# EAGLE schematic ARE_adaptadores_final (EAGLE 6.1)

## Sheet 1 of 4: dsPIC / 24F / PIC32 64pin
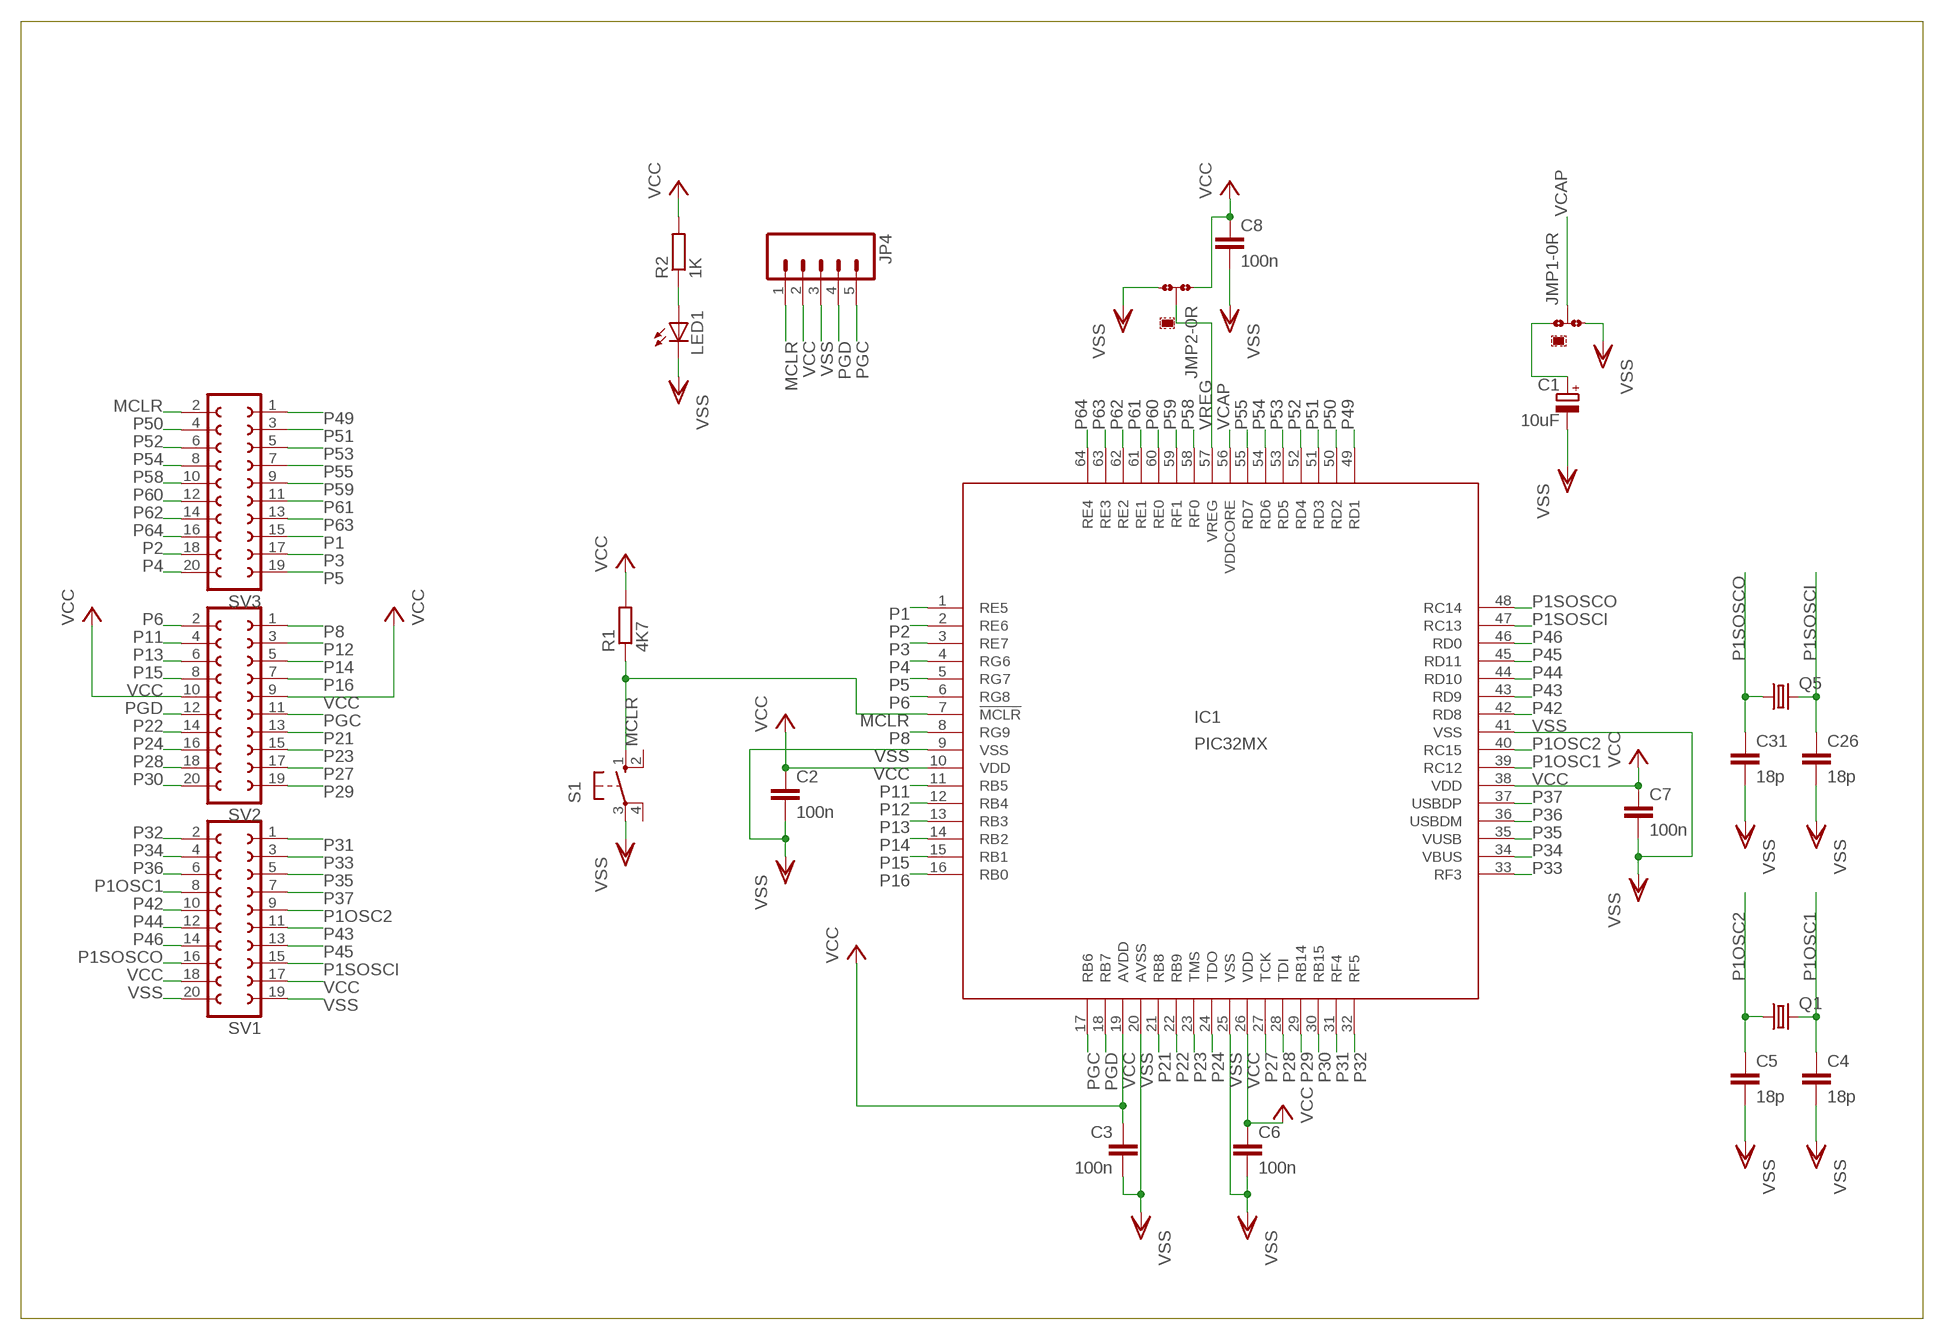
[diagram p0: schematic, sheet 1]

### Parts
C1  10uF  CPOL-EUSMCC  [SMC_C]
C2  100n  C-EUC0805  [C0805]
C3  100n  C-EUC0805  [C0805]
C4  18p  C-EUC0805  [C0805]
C5  18p  C-EUC0805  [C0805]
C6  100n  C-EUC0805  [C0805]
C7  100n  C-EUC0805  [C0805]
C8  100n  C-EUC0805  [C0805]
C26  18p  C-EUC0805  [C0805]
C31  18p  C-EUC0805  [C0805]
IC1  PIC32MX  PIC32MX440F256H  [TQFP64-10X10]
JMP1  0R-JUMPA  [A0R-JMP]
JMP2  0R-JUMPA  [A0R-JMP]
JP4  M05PTH  [1X05]
LED1  LEDCHIPLED_0805  [CHIPLED_0805]
Q1  CRYSTALHC18U-V  [HC18U-V]
Q5  CRYSTALHC18U-V  [HC18U-V]
R1  4K7  R-EU_R0805  [R0805]
R2  1K  R-EU_R0805  [R0805]
S1  10-XX  [B3F-10XX]
SV1  FE10-2W  [FE10-2W]
SV2  FE10-2W  [FE10-2W]
SV3  FE10-2W  [FE10-2W]

### Nets
MCLR: IC1.7(!MCLR) JP4.1 R1.1 S1.1(S) SV3.2
N$1: LED1.A R2.1
N$5: C1.+ JMP1.1
P1: IC1.1(RE5) SV3.15
P1OSC1: C4.1 IC1.39(RC12) Q1.2 SV1.8
P1OSC2: C5.1 IC1.40(RC15) Q1.1 SV1.9
P1SOSCI: C26.1 IC1.47(RC13) Q5.2 SV1.15
P1SOSCO: C31.1 IC1.48(RC14) Q5.1 SV1.16
P2: IC1.2(RE6) SV3.18
P3: IC1.3(RE7) SV3.17
P4: IC1.4(RG6) SV3.20
P5: IC1.5(RG7) SV3.19
P6: IC1.6(RG8) SV2.2
P8: IC1.8(RG9) SV2.1
P11: IC1.11(RB5) SV2.4
P12: IC1.12(RB4) SV2.3
P13: IC1.13(RB3) SV2.6
P14: IC1.14(RB2) SV2.5
P15: IC1.15(RB1) SV2.8
P16: IC1.16(RB0) SV2.7
P21: IC1.21(RB8) SV2.13
P22: IC1.22(RB9) SV2.14
P23: IC1.23(TMS) SV2.15
P24: IC1.24(TDO) SV2.16
P27: IC1.27(TCK) SV2.17
P28: IC1.28(TDI) SV2.18
P29: IC1.29(RB14) SV2.19
P30: IC1.30(RB15) SV2.20
P31: IC1.31(RF4) SV1.1
P32: IC1.32(RF5) SV1.2
P33: IC1.33(RF3) SV1.3
P34: IC1.34(VBUS) SV1.4
P35: IC1.35(VUSB) SV1.5
P36: IC1.36(USBDM) SV1.6
P37: IC1.37(USBDP) SV1.7
P42: IC1.42(RD8) SV1.10
P43: IC1.43(RD9) SV1.11
P44: IC1.44(RD10) SV1.12
P45: IC1.45(RD11) SV1.13
P46: IC1.46(RD0) SV1.14
P49: IC1.49(RD1) SV3.1
P50: IC1.50(RD2) SV3.4
P51: IC1.51(RD3) SV3.3
P52: IC1.52(RD4) SV3.6
P53: IC1.53(RD5) SV3.5
P54: IC1.54(RD6) SV3.8
P55: IC1.55(RD7) SV3.7
P58: IC1.58(RF0) SV3.10
P59: IC1.59(RF1) SV3.9
P60: IC1.60(RE0) SV3.12
P61: IC1.61(RE1) SV3.11
P62: IC1.62(RE2) SV3.14
P63: IC1.63(RE3) SV3.13
P64: IC1.64(RE4) SV3.16
PGC: IC1.17(RB6) JP4.5 SV2.11
PGD: IC1.18(RB7) JP4.4 SV2.12
VCAP: IC1.56(VDDCORE) JMP1.2
VCC: C2.1 C3.1 C6.1 C7.1 C8.1 IC1.10(VDD) IC1.19(AVDD) IC1.26(VDD) IC1.38(VDD) JMP2.1 JP4.2 R1.2 R2.2 SV1.17 SV1.18 SV2.9 SV2.10 ; also sheet 2,3,4
VREG: IC1.57(VREG) JMP2.2
VSS: C1.- C2.2 C3.2 C4.2 C5.2 C6.2 C7.2 C8.2 C26.2 C31.2 IC1.9(VSS) IC1.20(AVSS) IC1.25(VSS) IC1.41(VSS) JMP1.3 JMP2.3 JP4.3 LED1.C S1.3(P) SV1.19 SV1.20 ; also sheet 2,3,4
Unconnected: S1.2(S1) S1.4(P1)

## Sheet 2 of 4: dsPIC / 24F / PIC32 44 pin
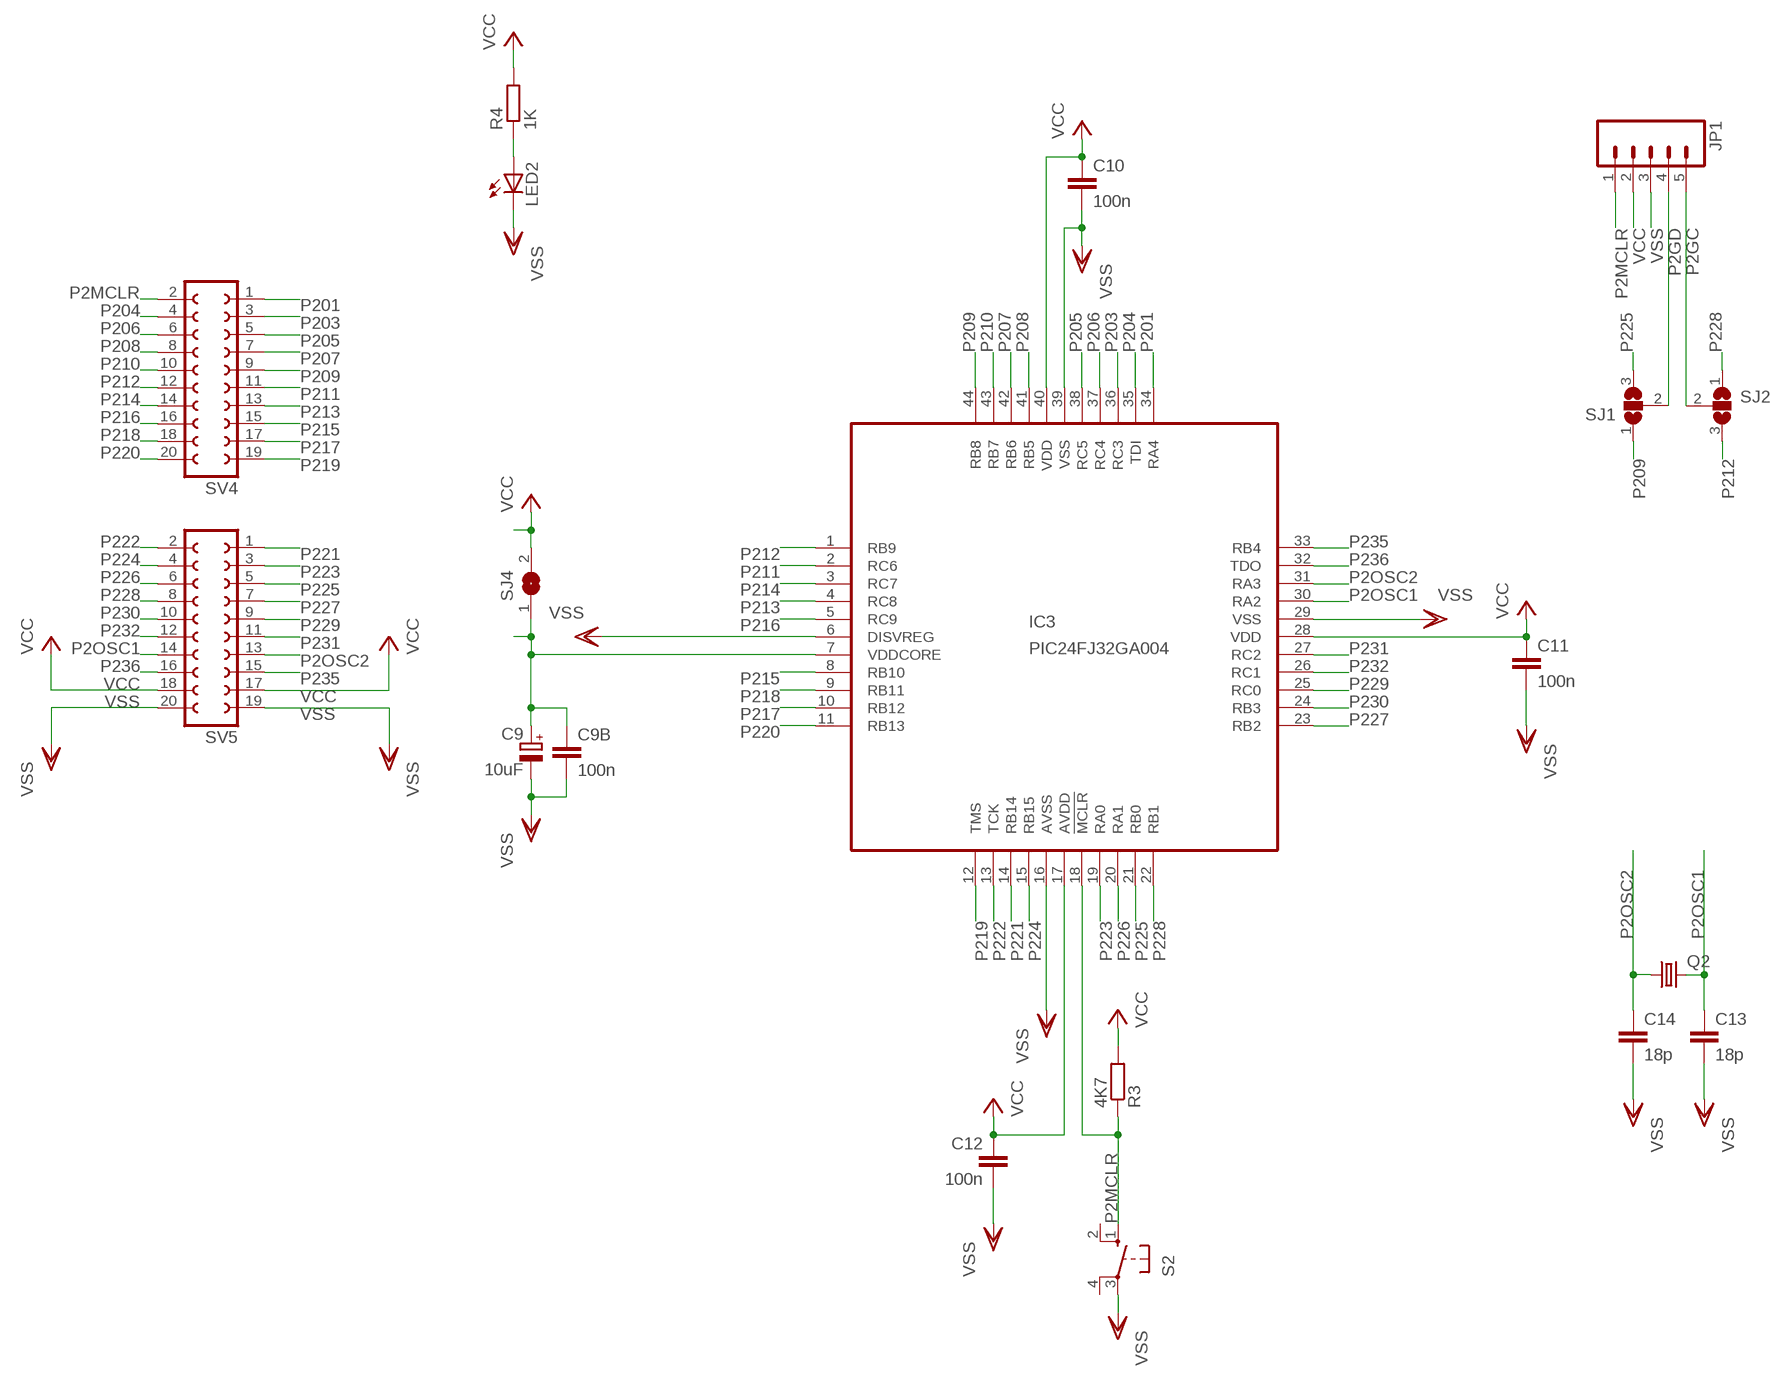
[diagram p1: schematic, sheet 2]

### Parts
C9  10uF  CPOL-EUSMCC  [SMC_C]
C9B  100n  C-EUC0805  [C0805]
C10  100n  C-EUC0805  [C0805]
C11  100n  C-EUC0805  [C0805]
C12  100n  C-EUC0805  [C0805]
C13  18p  C-EUC0805  [C0805]
C14  18p  C-EUC0805  [C0805]
IC3  PIC24FJ32GA004  [TQFP44]
JP1  M05PTH  [1X05]
LED2  LEDCHIPLED_0805  [CHIPLED_0805]
Q2  CRYSTALHC18U-V  [HC18U-V]
R3  4K7  R-EU_R0805  [R0805]
R4  1K  R-EU_R0805  [R0805]
S2  10-XX  [B3F-10XX]
SJ1  SJ2W  [SJ_2]
SJ2  SJ2W  [SJ_2]
SJ4  SJ  [SJ]
SV4  FE10-2W  [FE10-2W]
SV5  FE10-2W  [FE10-2W]

### Nets
N$2: LED2.A R4.1
N$11: C9.+ C9B.1 IC3.7(VDDCORE) SJ4.1
P2GC: JP1.5 SJ2.2
P2GD: JP1.4 SJ1.2
P2MCLR: IC3.18(!MCLR) JP1.1 R3.1 S2.1(S) SV4.2
P2OSC1: C13.1 IC3.30(RA2) Q2.2 SV5.14
P2OSC2: C14.1 IC3.31(RA3) Q2.1 SV5.13
P201: IC3.34(RA4) SV4.1
P203: IC3.36(RC3) SV4.3
P204: IC3.35(TDI) SV4.4
P205: IC3.38(RC5) SV4.5
P206: IC3.37(RC4) SV4.6
P207: IC3.42(RB6) SV4.7
P208: IC3.41(RB5) SV4.8
P209: IC3.44(RB8) SJ1.1 SV4.9
P210: IC3.43(RB7) SV4.10
P211: IC3.2(RC6) SV4.11
P212: IC3.1(RB9) SJ2.3 SV4.12
P213: IC3.4(RC8) SV4.13
P214: IC3.3(RC7) SV4.14
P215: IC3.8(RB10) SV4.15
P216: IC3.5(RC9) SV4.16
P217: IC3.10(RB12) SV4.17
P218: IC3.9(RB11) SV4.18
P219: IC3.12(TMS) SV4.19
P220: IC3.11(RB13) SV4.20
P221: IC3.14(RB14) SV5.1
P222: IC3.13(TCK) SV5.2
P223: IC3.19(RA0) SV5.3
P224: IC3.15(RB15) SV5.4
P225: IC3.21(RB0) SJ1.3 SV5.5
P226: IC3.20(RA1) SV5.6
P227: IC3.23(RB2) SV5.7
P228: IC3.22(RB1) SJ2.1 SV5.8
P229: IC3.25(RC0) SV5.9
P230: IC3.24(RB3) SV5.10
P231: IC3.27(RC2) SV5.11
P232: IC3.26(RC1) SV5.12
P235: IC3.33(RB4) SV5.15
P236: IC3.32(TDO) SV5.16
VCC: C10.1 C11.1 C12.1 IC3.17(AVDD) IC3.28(VDD) IC3.40(VDD) JP1.2 R3.2 R4.2 SJ4.2 SV5.17 SV5.18 ; also sheet 1,3,4
VSS: C9.- C9B.2 C10.2 C11.2 C12.2 C13.2 C14.2 IC3.6(DISVREG) IC3.16(AVSS) IC3.29(VSS) IC3.39(VSS) JP1.3 LED2.C S2.3(P) SV5.19 SV5.20 ; also sheet 1,3,4
Unconnected: S2.2(S1) S2.4(P1)

## Sheet 3 of 4: PIC 16F / 18F 44 pin
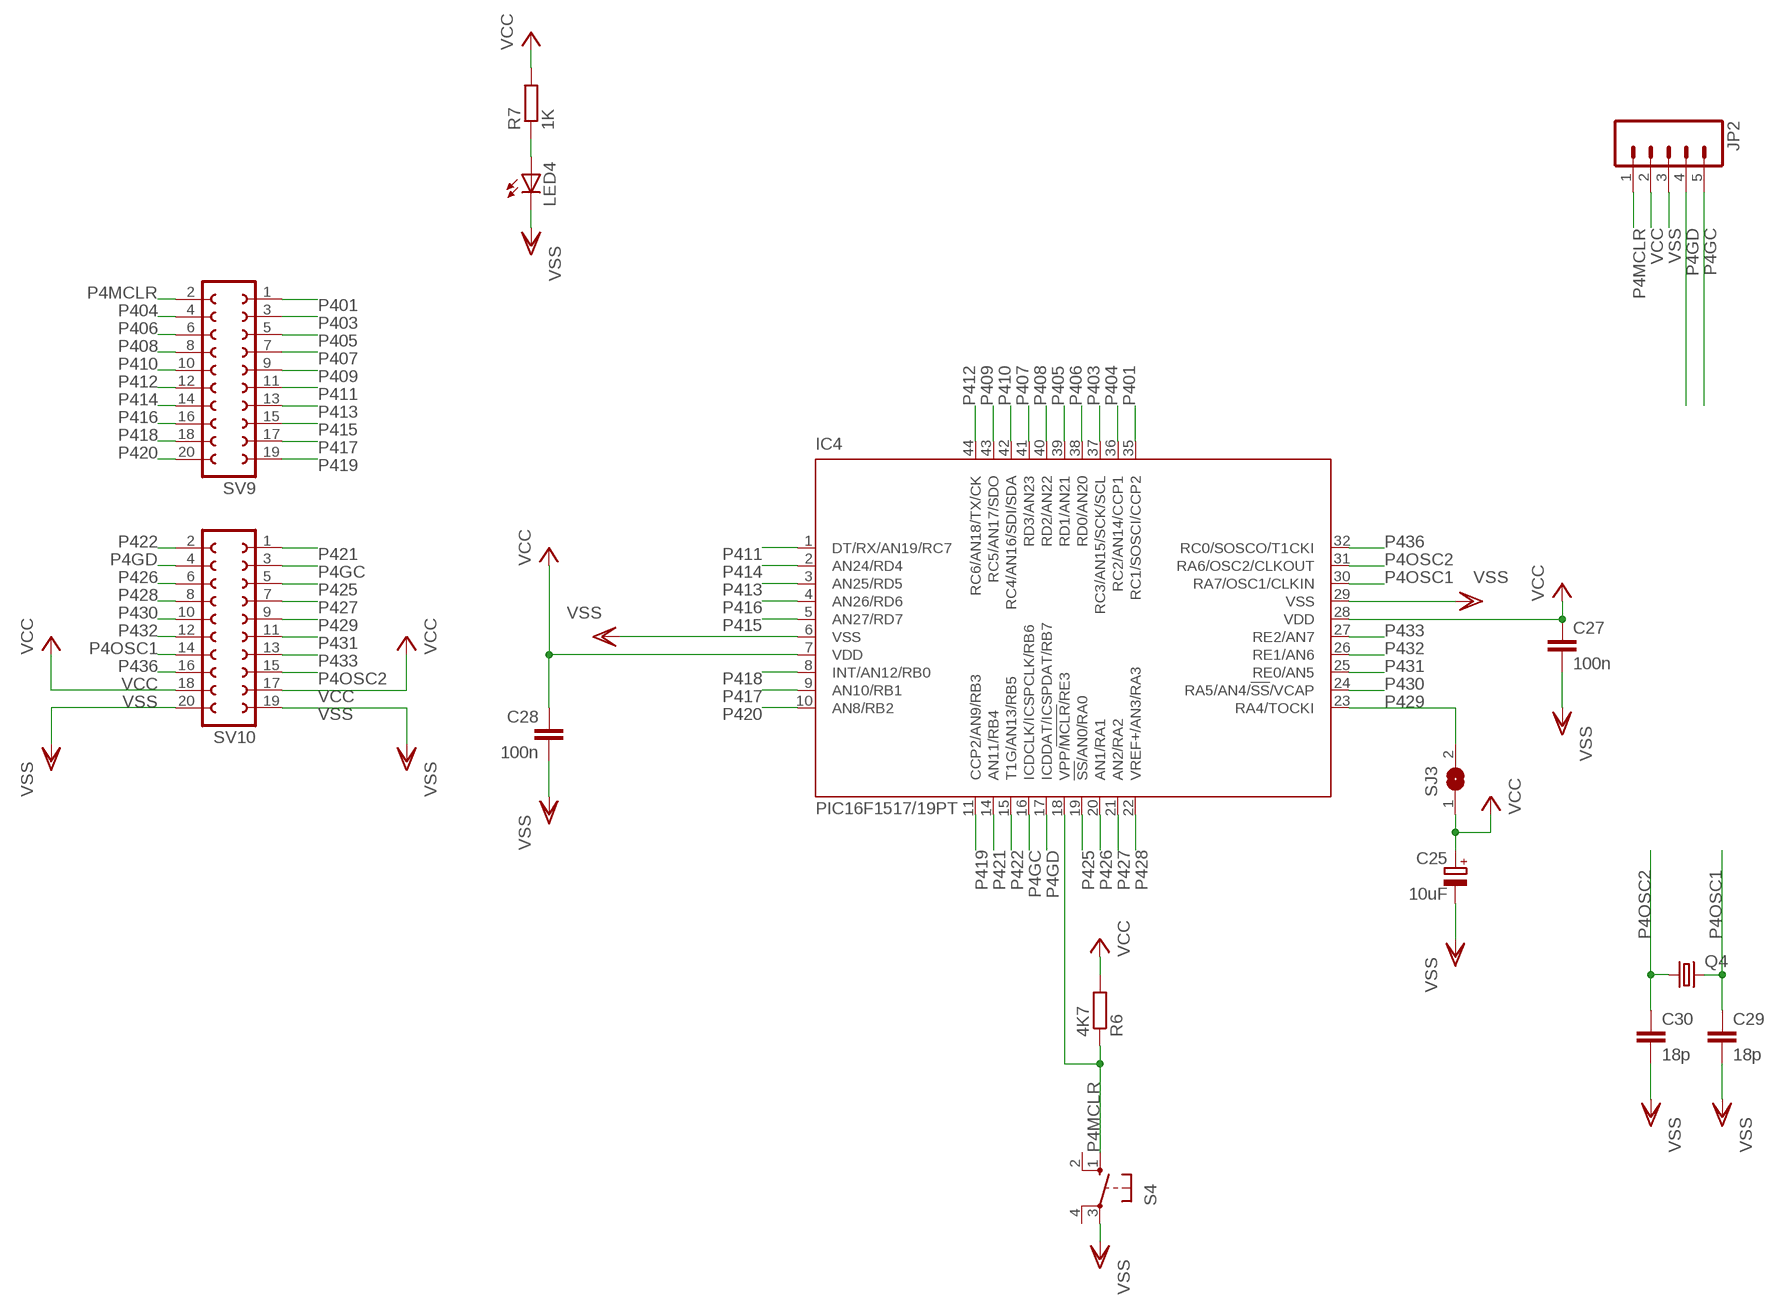
[diagram p2: schematic, sheet 3]

### Parts
C25  10uF  CPOL-EUSMCC  [SMC_C]
C27  100n  C-EUC0805  [C0805]
C28  100n  C-EUC0805  [C0805]
C29  18p  C-EUC0805  [C0805]
C30  18p  C-EUC0805  [C0805]
IC4  PIC16F1517/19PT  [TQFP44]
JP2  M05PTH  [1X05]
LED4  LEDCHIPLED_0805  [CHIPLED_0805]
Q4  CRYSTALHC18U-V  [HC18U-V]
R6  4K7  R-EU_R0805  [R0805]
R7  1K  R-EU_R0805  [R0805]
S4  10-XX  [B3F-10XX]
SJ3  SJ  [SJ]
SV9  FE10-2W  [FE10-2W]
SV10  FE10-2W  [FE10-2W]

### Nets
N$4: LED4.A R7.1
P4GC: IC4.16(ICDCLK/ICSPCLK/RB6) JP2.5 SV10.3
P4GD: IC4.17(ICDDAT/ICSPDAT/RB7) JP2.4 SV10.4
P4MCLR: IC4.18(VPP/!MCLR!/RE3) JP2.1 R6.1 S4.1(S) SV9.2
P4OSC1: C29.1 IC4.30(RA7/OSC1/CLKIN) Q4.2 SV10.14
P4OSC2: C30.1 IC4.31(RA6/OSC2/CLKOUT) Q4.1 SV10.15
P401: IC4.35(RC1/SOSCI/CCP2) SV9.1
P403: IC4.37(RC3/AN15/SCK/SCL) SV9.3
P404: IC4.36(RC2/AN14/CCP1) SV9.4
P405: IC4.39(RD1/AN21) SV9.5
P406: IC4.38(RD0/AN20) SV9.6
P407: IC4.41(RD3/AN23) SV9.7
P408: IC4.40(RD2/AN22) SV9.8
P409: IC4.43(RC5/AN17/SDO) SV9.9
P410: IC4.42(RC4/AN16/SDI/SDA) SV9.10
P411: IC4.1(DT/RX/AN19/RC7) SV9.11
P412: IC4.44(RC6/AN18/TX/CK) SV9.12
P413: IC4.3(AN25/RD5) SV9.13
P414: IC4.2(AN24/RD4) SV9.14
P415: IC4.5(AN27/RD7) SV9.15
P416: IC4.4(AN26/RD6) SV9.16
P417: IC4.9(AN10/RB1) SV9.17
P418: IC4.8(INT/AN12/RB0) SV9.18
P419: IC4.11(CCP2/AN9/RB3) SV9.19
P420: IC4.10(AN8/RB2) SV9.20
P421: IC4.14(AN11/RB4) SV10.1
P422: IC4.15(T1G/AN13/RB5) SV10.2
P425: IC4.19(!SS!/AN0/RA0) SV10.5
P426: IC4.20(AN1/RA1) SV10.6
P427: IC4.21(AN2/RA2) SV10.7
P428: IC4.22(VREF+/AN3/RA3) SV10.8
P429: IC4.23(RA4/TOCKI) SJ3.2 SV10.9
P430: IC4.24(RA5/AN4/!SS!/VCAP) SV10.10
P431: IC4.25(RE0/AN5) SV10.11
P432: IC4.26(RE1/AN6) SV10.12
P433: IC4.27(RE2/AN7) SV10.13
P436: IC4.32(RC0/SOSCO/T1CKI) SV10.16
VCC: C25.+ C27.1 C28.1 IC4.7(VDD) IC4.28(VDD) JP2.2 R6.2 R7.2 SJ3.1 SV10.17 SV10.18 ; also sheet 1,2,4
VSS: C25.- C27.2 C28.2 C29.2 C30.2 IC4.6(VSS) IC4.29(VSS) JP2.3 LED4.C S4.3(P) SV10.19 SV10.20 ; also sheet 1,2,4
Unconnected: S4.2(S1) S4.4(P1)

## Sheet 4 of 4: PIC 10F / 12F / 16F 8pin / 14pin
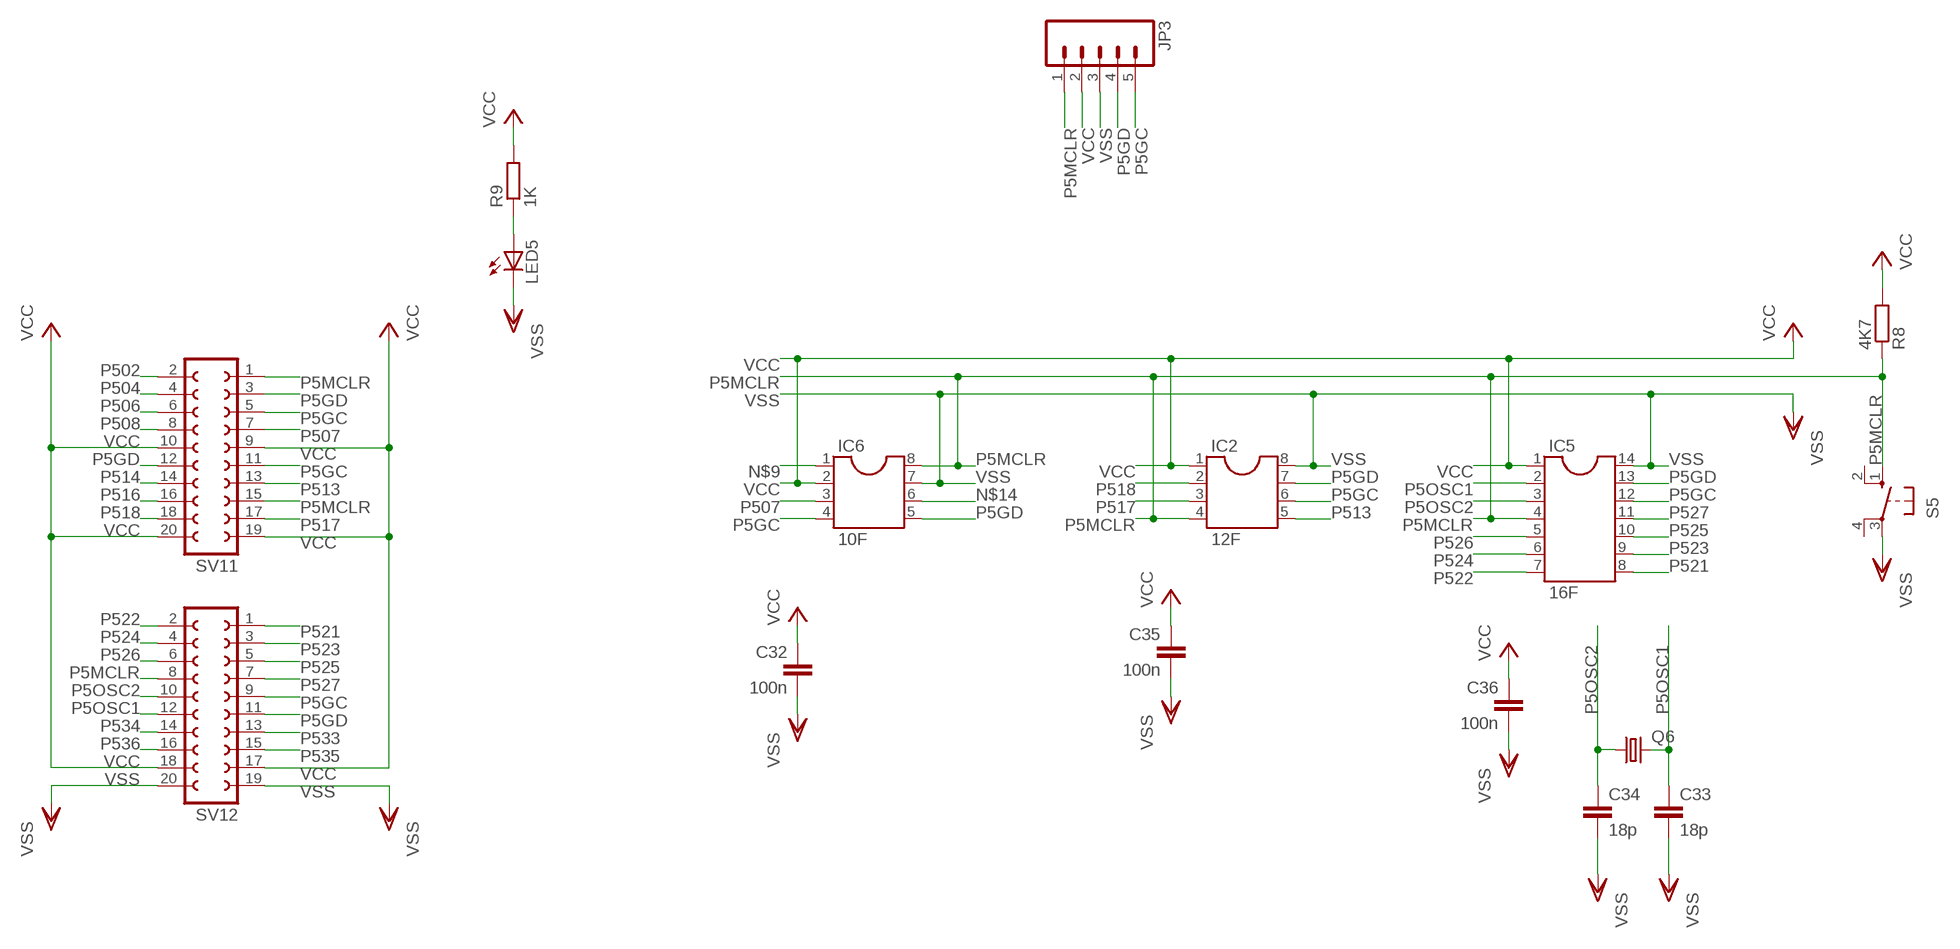
[diagram p3: schematic, sheet 4]

### Parts
C32  100n  C-EUC0805  [C0805]
C33  18p  C-EUC0805  [C0805]
C34  18p  C-EUC0805  [C0805]
C35  100n  C-EUC0805  [C0805]
C36  100n  C-EUC0805  [C0805]
IC2  12F  DIL8S  [SOCKET-08]
IC5  16F  DIL14S  [SOCKET-14]
IC6  10F  DIL8S  [SOCKET-08]
JP3  M05PTH  [1X05]
LED5  LEDCHIPLED_0805  [CHIPLED_0805]
Q6  CRYSTALHC18U-V  [HC18U-V]
R8  4K7  R-EU_R0805  [R0805]
R9  1K  R-EU_R0805  [R0805]
S5  10-XX  [B3F-10XX]
SV11  FE10-2W  [FE10-2W]
SV12  FE10-2W  [FE10-2W]

### Nets
N$8: LED5.A R9.1
N$9: IC6.1
N$14: IC6.6
P5GC: IC2.6 IC5.12 IC6.4 JP3.5 SV11.5 SV11.11 SV12.9
P5GD: IC2.7 IC5.13 IC6.5 JP3.4 SV11.3 SV11.12 SV12.11
P5MCLR: IC2.4 IC5.4 IC6.8 JP3.1 R8.1 S5.1(S) SV11.1 SV11.15 SV12.8
P5OSC1: C33.1 IC5.2 Q6.2 SV12.12
P5OSC2: C34.1 IC5.3 Q6.1 SV12.10
P502: SV11.2
P504: SV11.4
P506: SV11.6
P507: IC6.3 SV11.7
P508: SV11.8
P513: IC2.5 SV11.13
P514: SV11.14
P516: SV11.16
P517: IC2.3 SV11.17
P518: IC2.2 SV11.18
P521: IC5.8 SV12.1
P522: IC5.7 SV12.2
P523: IC5.9 SV12.3
P524: IC5.6 SV12.4
P525: IC5.10 SV12.5
P526: IC5.5 SV12.6
P527: IC5.11 SV12.7
P533: SV12.13
P534: SV12.14
P535: SV12.15
P536: SV12.16
VCC: C32.1 C35.1 C36.1 IC2.1 IC5.1 IC6.2 JP3.2 R8.2 R9.2 SV11.9 SV11.10 SV11.19 SV11.20 SV12.17 SV12.18 ; also sheet 1,2,3
VSS: C32.2 C33.2 C34.2 C35.2 C36.2 IC2.8 IC5.14 IC6.7 JP3.3 LED5.C S5.3(P) SV12.19 SV12.20 ; also sheet 1,2,3
Unconnected: S5.2(S1) S5.4(P1)

## Library data of the parts
C1 C9 C25 = rcl:CPOL-EU: POLARIZED CAPACITOR, European symbol
C2-C8 C9B C10-C14 C26-C36 = rcl:C-EU: CAPACITOR, European symbol
IC1 = microchip_nuevo:PIC32MX440F256H: PIC32MX440F256H edit this description Auto generated by make-symbol-device-package-bsdl.ulp Rev. 25 Source: PIC32MX440F256H.bsdl
IC2 IC6 = ic-package:DIL8: Dual In Line / Socket
IC3 = microchip:PIC24FJ32GA004: PIC24FJ32GA004 edit this description Auto generated by make-symbol-device-package-bsdl.ulp Rev. 25 Source: PIC24FJ32GA004.bsd; MPN: PIC24FJ32GA004-E/PT; OC_FARNELL: 1332295; OC_NEWARK: 98M1915
IC4 = microchip:PIC16*F1517/19: 28/40/44-Pin Flash Microcontrollers with nanoWatt XLP Technology PIC16F1517/1519 AND PIC16LF1517/1519 Source: www.microchip.com PIC16F1516.pdf
IC5 = ic-package:DIL14: Dual In Line / Socket
JMP1 JMP2 = jump-0r-smd:0R-JUMP: SMD 0R 0805 Jumper
JP1-JP4 = SparkFun:M05: Header 5 Standard 5-pin 0.1" header. Use with straight break away headers (SKU : PRT-00116), right angle break away headers (PRT-00553), swiss pins (PRT-00743), machine pins (PRT-00117), and female headers (PRT-00115). Molex polarized connector foot print use with SKU : PRT-08230 with associated crimp pins and housings.
LED1 LED2 LED4 LED5 = led:LED: LED OSRAM: - CHIPLED LG R971, LG N971, LY N971, LG Q971, LY Q971, LO R971, LY R971 LH N974, LH R974 LS Q976, LO Q976, LY Q976 LO Q996 - Hyper CHIPLED LW Q18S LB Q993, LB Q99A, LB R99A - SideLED LS A670, LO A670, LY A670, LG A670, LP A670 LB A673, LV A673, LT A673, LW A673 LH A674 LY A675 LS A676, LA A676, LO A676, LY A676, LW A676 LS A679, LY A679, LG A679 - Hyper Micro SIDELED® LS Y876, LA Y876, LO Y876, LY Y876 LT Y87S - SmartLED LW L88C, LW L88S LB L89C, LB L89S, LG L890 LS L89K, LO L89K, LY L89K LS L896, LA L896, LO L896, LY L896 - TOPLED LS T670, LO T670, LY T670, LG T670, LP T670 LSG T670, LSP T670, LSY T670, LOP T670, LYG T670 LG T671, LOG T671, LSG T671 LB T673, LV T673, LT T673, LW T673 LH T674 LS T676, LA T676, LO T676, LY T676, LB T676, LH T676, LSB T676, LW T676 LB T67C, LV T67C, LT T67C, LS T67K, LO T67K, LY T67K, LW E67C LS E67B, LA E67B, LO E67B, LY E67B, LB E67C, LV E67C, LT E67C LW T67C LS T679, LY T679, LG T679 LS T770, LO T770, LY T770, LG T770, LP T770 LB T773, LV T773, LT T773, LW T773 LH T774 LS E675, LA E675, LY E675, LS T675 LS T776, LA T776, LO T776, LY T776, LB T776 LHGB T686 LT T68C, LB T68C - Hyper Mini TOPLED® LB M676 - Mini TOPLED Santana® LG M470 LS M47K, LO M47K, LY M47K Source: http://www.osram.convergy.de LUXEON: - LUMILED® LXK2-PW12-R00, LXK2-PW12-S00, LXK2-PW14-U00, LXK2-PW14-V00 LXK2-PM12-R00, LXK2-PM12-S00, LXK2-PM14-U00 LXK2-PE12-Q00, LXK2-PE12-R00, LXK2-PE12-S00, LXK2-PE14-T00, LXK2-PE14-U00 LXK2-PB12-K00, LXK2-PB12-L00, LXK2-PB12-M00, LXK2-PB14-N00, LXK2-PB14-P00, LXK2-PB14-Q00 LXK2-PR12-L00, LXK2-PR12-M00, LXK2-PR14-Q00, LXK2-PR14-R00 LXK2-PD12-Q00, LXK2-PD12-R00, LXK2-PD12-S00 LXK2-PH12-R00, LXK2-PH12-S00 LXK2-PL12-P00, LXK2-PL12-Q00, LXK2-PL12-R00 Source: www.luxeon.com KINGBRIGHT: KA-3528ASYC Source: www.kingbright.com
Q1 Q2 Q4-Q6 = crystal:CRYSTAL: CRYSTAL; OC_FARNELL: unknown; OC_NEWARK: unknown
R1-R4 R6-R9 = rcl:R-EU_: RESISTOR, European symbol
S1 S2 S4 S5 = switch-omron:10-XX: OMRON SWITCH; MPN: B3F-1000; OC_FARNELL: 176432; OC_NEWARK: 36M3542
SJ1 SJ2 = jumper:SJ2W: SMD solder JUMPER
SJ3 SJ4 = jumper:SJ: SMD solder JUMPER
SV1-SV5 SV9-SV12 = con-lsta:FE10-2W: FEMALE HEADER; OC_FARNELL: unknown; OC_NEWARK: unknown